# EAGLE schematic reactor (EAGLE 6.4)
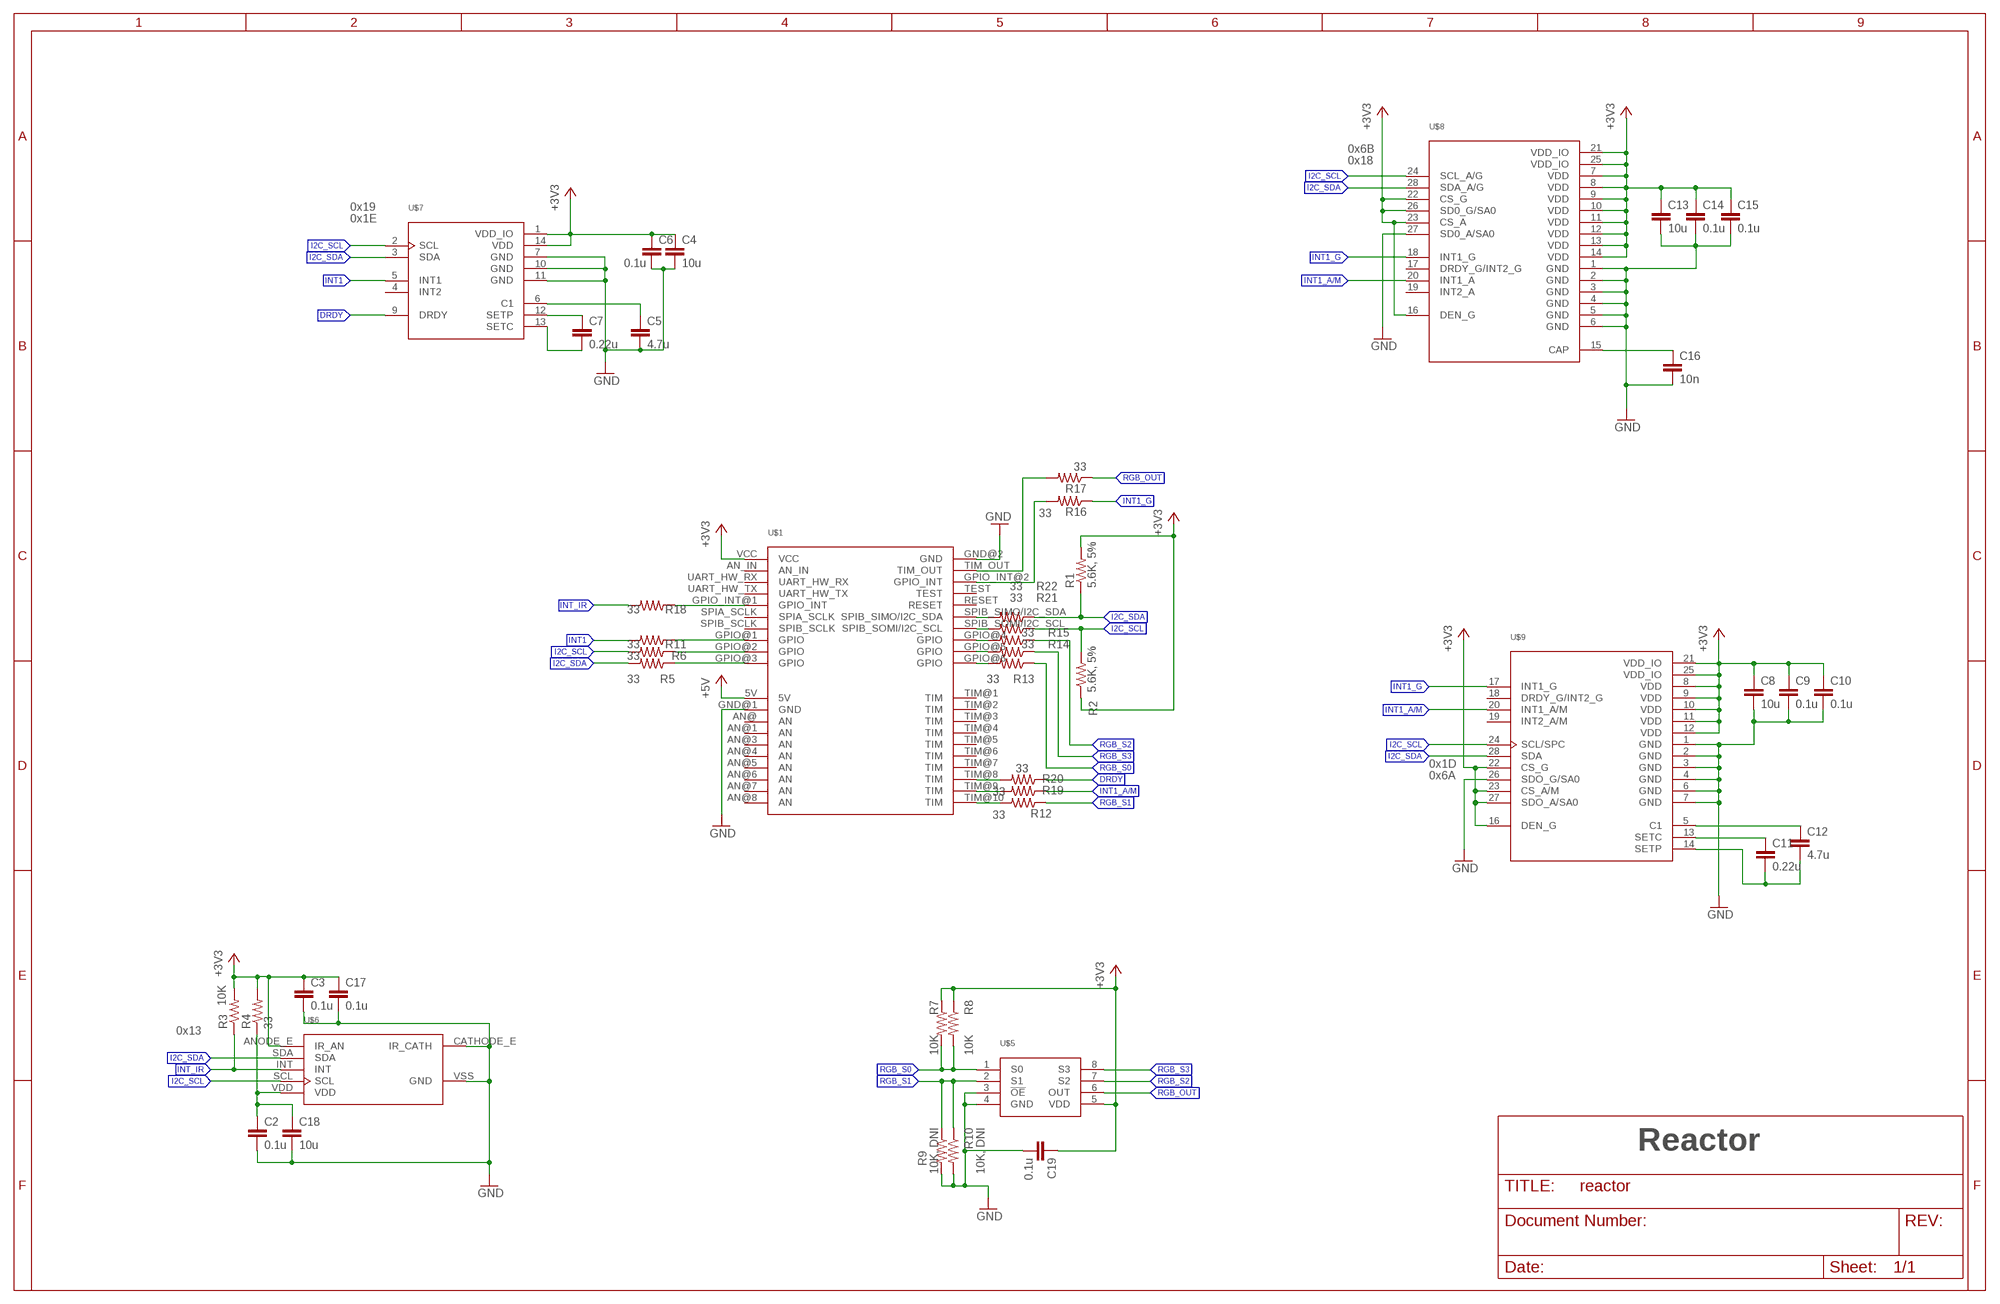
[diagram p0: schematic, sheet 1]

## Parts
C2  0.1u  C-EUC0603  [C0603]
C3  0.1u  C-EUC0603  [C0603]
C4  10u  C-EUC0603  [C0603]
C5  4.7u  C-EUC0603  [C0603]
C6  0.1u  C-EUC0603  [C0603]
C7  0.22u  C-EUC0603  [C0603]
C8  10u  C-EUC0603  [C0603]
C9  0.1u  C-EUC0603  [C0603]
C10  0.1u  C-EUC0603  [C0603]
C11  0.22u  C-EUC0603  [C0603]
C12  4.7u  C-EUC0603  [C0603]
C13  10u  C-EUC0603  [C0603]
C14  0.1u  C-EUC0603  [C0603]
C15  0.1u  C-EUC0603  [C0603]
C16  10n  C-EUC0603  [C0603]
C17  0.1u  C-EUC0603  [C0603]
C18  10u  C-EUC0603  [C0603]
C19  0.1u  C-EUC0603  [C0603]
R1  5.6K, 5%  R-US_R0603  [R0603]
R2  5.6K, 5%  R-US_R0603  [R0603]
R3  10K  R-US_R0603  [R0603]
R4  33  R-US_R0603  [R0603]
R5  33  R-US_R0603  [R0603]
R6  33  R-US_R0603  [R0603]
R7  10K  R-US_R0603  [R0603]
R8  10K  R-US_R0603  [R0603]
R9  10K, DNI  R-US_R0603  [R0603]
R10  10K, DNI  R-US_R0603  [R0603]
R11  33  R-US_R0603  [R0603]
R12  33  R-US_R0603  [R0603]
R13  33  R-US_R0603  [R0603]
R14  33  R-US_R0603  [R0603]
R15  33  R-US_R0603  [R0603]
R16  33  R-US_R0603  [R0603]
R17  33  R-US_R0603  [R0603]
R18  33  R-US_R0603  [R0603]
R19  33  R-US_R0603  [R0603]
R20  33  R-US_R0603  [R0603]
R21  33  R-US_R0603  [R0603]
R22  33  R-US_R0603  [R0603]
U$1  LAUNCHPAD_BOOSTER_PACK  [LAUNCHPAD_BOOSTER_PACK]
U$5  TCS32X0  [SOIC8]
U$6  VCNL3020  [VCNL3020]
U$7  LSM303DLHC  [LGA14]
U$8  LSM330DLC  [LGA28-4X5]
U$9  LSM333D  [LGA28]

## Nets
+3V3 [pwr]: C3.1 C4.1 C6.1 C8.1 C9.1 C10.1 C13.1 C14.1 C15.1 C17.1 C19.1 R1.2 R2.1 R3.2 R4.2 R7.1 R8.1 U$1.VCC U$5.5(VDD) U$6.ANODE_E(IR_AN) U$7.1(VDD_IO) U$7.14(VDD) U$8.7(VDD) U$8.8(VDD) U$8.9(VDD) U$8.10(VDD) U$8.11(VDD) U$8.12(VDD) U$8.13(VDD) U$8.14(VDD) U$8.16(DEN_G) U$8.21(VDD_IO) U$8.22(CS_G) U$8.23(CS_A) U$8.25(VDD_IO) U$8.26(SD0_G/SA0) U$9.8(VDD) U$9.9(VDD) U$9.10(VDD) U$9.11(VDD) U$9.12(VDD) U$9.16(DEN_G) U$9.21(VDD_IO) U$9.22(CS_G) U$9.23(CS_A/M) U$9.25(VDD_IO) U$9.27(SDO_A/SA0)
+5V: U$1.5V
DRDY: R20.1 U$7.9(DRDY)
GND [pwr]: C2.2 C3.2 C4.2 C5.2 C6.2 C8.2 C9.2 C10.2 C13.2 C14.2 C15.2 C16.2 C17.2 C18.2 C19.2 R9.2 R10.2 U$1.GND@1(GND) U$1.GND@2(GND) U$5.3(!OE) U$5.4(GND) U$6.CATHODE_E(IR_CATH) U$6.VSS(GND) U$7.7(GND) U$7.10(GND) U$7.11(GND) U$8.1(GND) U$8.2(GND) U$8.3(GND) U$8.4(GND) U$8.5(GND) U$8.6(GND) U$8.27(SD0_A/SA0) U$9.1(GND) U$9.2(GND) U$9.3(GND) U$9.4(GND) U$9.6(GND) U$9.7(GND) U$9.26(SDO_G/SA0)
I2C_SCL: R2.2 R6.2 R21.1 U$6.SCL U$7.2(SCL) U$8.24(SCL_A/G) U$9.24(SCL/SPC)
I2C_SDA: R1.1 R5.2 R22.1 U$6.SDA U$7.3(SDA) U$8.28(SDA_A/G) U$9.28(SDA)
INT1: R11.2 U$7.5(INT1)
INT1_A/M: R19.1 U$8.20(INT1_A) U$9.20(INT1_A/M)
INT1_G: R16.1 U$8.18(INT1_G) U$9.17(INT1_G)
INT_IR: R3.1 R18.2 U$6.INT
N$1: C2.1 C18.1 R4.1 U$6.VDD
N$2: R18.1 U$1.GPIO_INT@1(GPIO_INT)
N$3: R11.1 U$1.GPIO@1(GPIO)
N$4: R19.2 U$1.TIM@9(TIM)
N$5: R20.2 U$1.TIM@8(TIM)
N$6: R6.1 U$1.GPIO@2(GPIO)
N$7: R5.1 U$1.GPIO@3(GPIO)
N$8: R21.2 U$1.SPIB_SOMI/I2C_SCL
N$9: R22.2 U$1.SPIB_SIMO/I2C_SDA
N$10: R12.2 U$1.TIM@10(TIM)
N$12: R15.2 U$1.GPIO@4(GPIO)
N$13: R14.2 U$1.GPIO@5(GPIO)
N$14: R13.2 U$1.GPIO@6(GPIO)
N$18: R17.2 U$1.TIM_OUT
N$19: R16.2 U$1.GPIO_INT@2(GPIO_INT)
N$45: C7.1 U$7.12(SETP)
N$46: C7.2 U$7.13(SETC)
N$47: C5.1 U$7.6(C1)
N$48: C16.1 U$8.15(CAP)
N$50: C11.1 U$9.13(SETC)
N$51: C11.2 C12.2 U$9.14(SETP)
N$52: C12.1 U$9.5(C1)
RGB_OUT: R17.1 U$5.6(OUT)
RGB_S0: R7.2 R8.2 R13.1 U$5.1(S0)
RGB_S1: R9.1 R10.1 R12.1 U$5.2(S1)
RGB_S2: R15.1 U$5.7(S2)
RGB_S3: R14.1 U$5.8(S3)
Unconnected: U$1.AN@1(AN) U$1.AN@3(AN) U$1.AN@4(AN) U$1.AN@5(AN) U$1.AN@6(AN) U$1.AN@7(AN) U$1.AN@8(AN) U$1.AN@(AN) U$1.AN_IN U$1.RESET U$1.SPIA_SCLK U$1.SPIB_SCLK U$1.TEST U$1.TIM@1(TIM) U$1.TIM@2(TIM) U$1.TIM@3(TIM) U$1.TIM@4(TIM) U$1.TIM@5(TIM) U$1.TIM@6(TIM) U$1.TIM@7(TIM) U$1.UART_HW_RX U$1.UART_HW_TX U$7.4(INT2) U$8.17(DRDY_G/INT2_G) U$8.19(INT2_A) U$9.18(DRDY_G/INT2_G) U$9.19(INT2_A/M)

## Notes on the sheet
- 0x6B
- 0x18
- 0x19
- 0x1E
- 0x1D
- 0x6A
- 0x13
- Reactor

## Library data of the parts
C2 C3 C6 C9 C10 C14 C15 C19 = rcl:C-EU: CAPACITOR, European symbol; MPN: VJ0603V104ZXXCW1BC
C4 C8 C13 C17 C18 = rcl:C-EU: CAPACITOR, European symbol; MPN: LMK107BBJ106MALT
C5 C12 = rcl:C-EU: CAPACITOR, European symbol; MPN: GRM188F51A475ZE20J
C7 C11 = rcl:C-EU: CAPACITOR, European symbol; MPN: VJ0603V224MXJPW1BC
C16 = rcl:C-EU: CAPACITOR, European symbol; MPN: VJ0603Y103KXACW1BC
R1 R2 = rcl:R-US_: RESISTOR, American symbol; MPN: RK73B1JTTDD562J
R3 R7-R10 = rcl:R-US_: RESISTOR, American symbol; MPN: WR06X1002FTL
R4-R6 R11-R22 = rcl:R-US_: RESISTOR, American symbol; MPN: CR0402-JW-330GLF
U$1 = Boards:LAUNCHPAD_BOOSTER_PACK
U$5 = launchpad_bp:TCS32X0; MPN: TCS32X0
U$6 = launchpad_bp:VCNL3020; MPN: VCNL3020
U$7 = BoneCapeParts:LSM303DLHC; MPN: LSM303DLHC
U$8 = BoneCapeParts:LSM330DLC; MPN: LSM330DLC
U$9 = BoneCapeParts:LSM333D; MPN: LSM333D

## Net classes
0 default: width 0.152 mm, drill 0.381 mm, clearance 0.152 mm
1 pwr: width 0.203 mm, drill 0.381 mm, clearance 0.152 mm